# EAGLE schematic LED_PCB_Schematic (EAGLE 9.7.0)
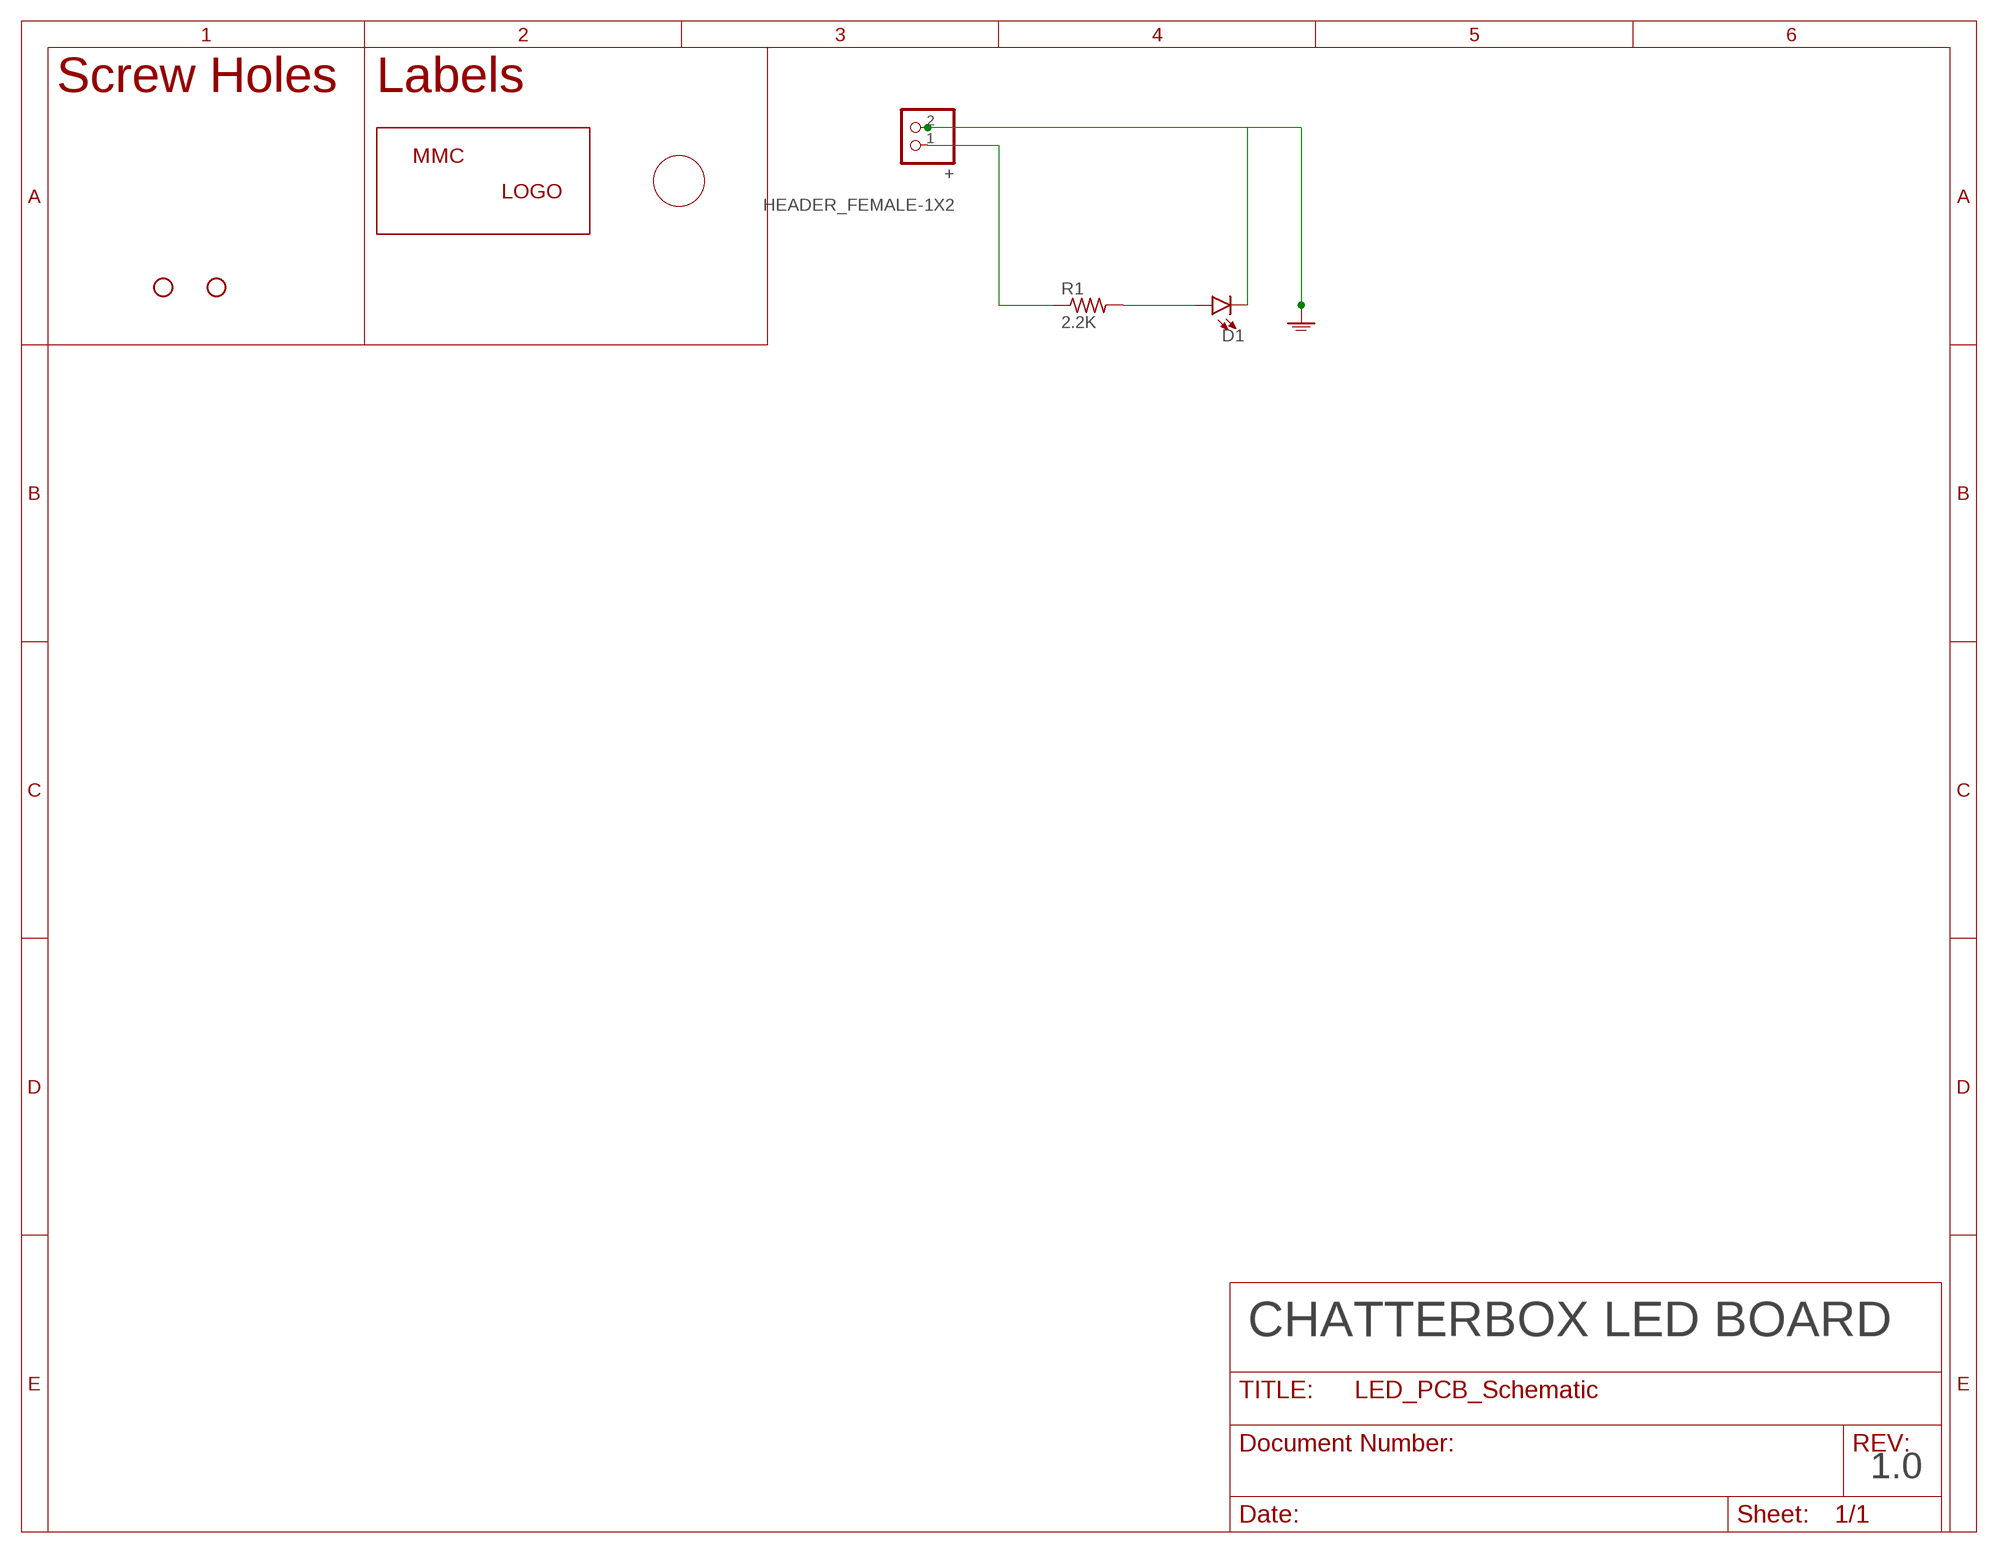
[diagram p0: schematic, sheet 1]

## Parts
+  HEADER_FEMALE-1X2  [HEADER_FEMALE-1X02]
D1  LED_5MM-5MM  [LED_5MM]
R1  2.2K  R-US_0309/12  [0309/12]
U$1  MMC_LABEL-BACK  [LABEL-BACK]
U$2  STAND-OFF-  [STAND-OFF]
U$3  STAND-OFF-  [STAND-OFF]
U$4  MMC_LOGO-XSM  [MMC_X-SMALL_LOGO]

## Nets
GND1: +.2 D1.K(C) ; supply symbol labelled GND
N$1: +.1 R1.1
N$2: D1.A R1.2

## Notes on the sheet
- Screw Holes | Labels
- CHATTERBOX LED BOARD
- 1.0

## Library data of the parts
+ = MMC_Eagle:HEADER_FEMALE-1X2
D1 = MMC_Eagle:LED_5MM-: LED (Generic) Standard schematic elements and footprints for 5mm, 3mm, 1206, and 0603 sized LEDs. Generic LEDs with no color specified.
R1 = adafruit:R-US_: RESISTOR, American symbol
U$1 = MMC_Eagle:MMC_LABEL-
U$2 U$3 = MMC_Eagle:STAND-OFF-
U$4 = MMC_Eagle:MMC_LOGO-